# Altium schematic sheet uC_pwr.SchDoc
size A4
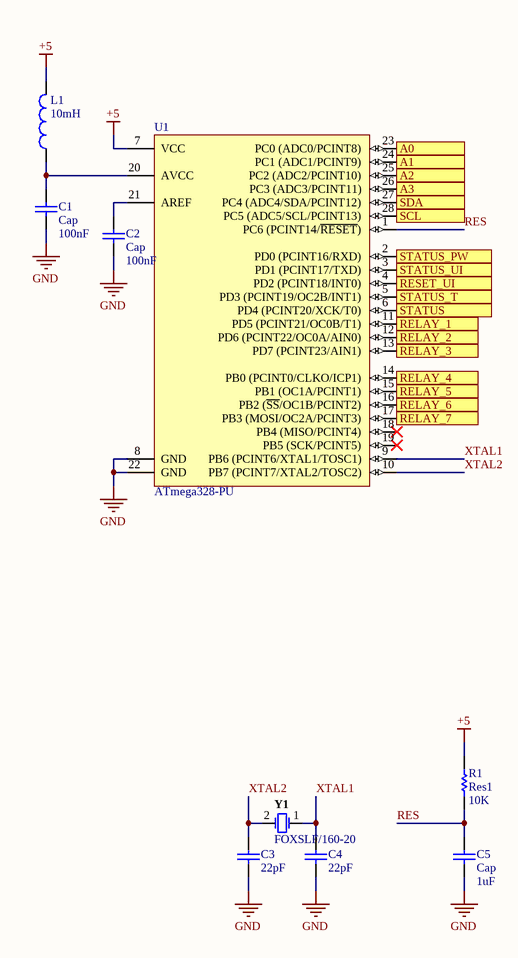
[diagram p0: uC_pwr.SchDoc]

## Parts
C1  Cap  value 100nF  [RAD-0.3]
C2  Cap  value 100nF  [RAD-0.3]
C3  value 22pF  [RAD-0.3]  (hidden comment: Cap)
C4  value 22pF  [RAD-0.3]  (hidden comment: Cap)
C5  Cap  value 1uF  [RAD-0.3]
L1  10mH  [INDR62-500-1100X850X1100]
R1  Res1  value 10K  [AXIAL-0.3]
U1  ATmega328-PU  [28P3]
Y1  FOXSLF/160-20  [FOX-FOXSLF160-20]

## Ports
A0 (in), A1 (in), A2 (in), A3 (in), RELAY_1 (out), RELAY_2 (out), RELAY_3 (out), RELAY_4 (out), RELAY_5 (out), RELAY_6 (out), RELAY_7 (out), RESET_UI (out), SCL (out), SDA (out), STATUS (in), STATUS_PW (out), STATUS_T (out), STATUS_UI (in)

## Nets
+5: L1.2 R1.2 U1.7(VCC)
GND: C1.1 C2.1 C3.1 C4.1 C5.1 U1.8(GND) U1.22(GND)
A0: U1.23(PC0_(ADC0/PCINT8)) ; port A0
A1: U1.24(PC1_(ADC1/PCINT9)) ; port A1
A2: U1.25(PC2_(ADC2/PCINT10)) ; port A2
A3: U1.26(PC3_(ADC3/PCINT11)) ; port A3
RELAY_1: U1.11(PD5_(PCINT21/OC0B/T1)) ; port RELAY_1
RELAY_2: U1.12(PD6_(PCINT22/OC0A/AIN0)) ; port RELAY_2
RELAY_3: U1.13(PD7_(PCINT23/AIN1)) ; port RELAY_3
RELAY_4: U1.14(PB0_(PCINT0/CLKO/ICP1)) ; port RELAY_4
RELAY_5: U1.15(PB1_(OC1A/PCINT1)) ; port RELAY_5
RELAY_6: U1.16(PB2_(~{SS}/OC1B/PCINT2)) ; port RELAY_6
RELAY_7: U1.17(PB3_(MOSI/OC2A/PCINT3)) ; port RELAY_7
RES: C5.2 R1.1 U1.1(PC6_(PCINT14/~{RESET}))
RESET_UI: U1.4(PD2_(PCINT18/INT0)) ; port RESET_UI
SCL: U1.28(PC5_(ADC5/SCL/PCINT13)) ; port SCL
SDA: U1.27(PC4_(ADC4/SDA/PCINT12)) ; port SDA
STATUS: U1.6(PD4_(PCINT20/XCK/T0)) ; port STATUS
STATUS_PW: U1.2(PD0_(PCINT16/RXD)) ; port STATUS_PW
STATUS_T: U1.5(PD3_(PCINT19/OC2B/INT1)) ; port STATUS_T
STATUS_UI: U1.3(PD1_(PCINT17/TXD)) ; port STATUS_UI
XTAL1: C4.2 U1.9(PB6_(PCINT6/XTAL1/TOSC1)) Y1.1
XTAL2: C3.2 U1.10(PB7_(PCINT7/XTAL2/TOSC2)) Y1.2
NetC1_2: C1.2 L1.1 U1.20(AVCC)
NetC2_2: C2.2 U1.21(AREF)

Not connected (* = marked no-connect by the designer): U1 18(PB4_(MISO/PCINT4))* 19(PB5_(SCK/PCINT5))*

## Library data of the parts
C1-C5 = Cap: Capacitor; Published: 8-Jun-2000; LatestRevisionDate: 17-Jul-2002; LatestRevisionNote: Re-released for DXP Platform.; PackageReference: RAD-0.3; Publisher: Altium Limited; PackageDescription: Radial Cap, Thru-Hole; 2 Leads; 0.3 in Pin Spacing
L1 = CMP-1747-00016-1: Radial Inductor, 10 uH, +/- 10%, 3 A, -55 to 105 degC, 2-Pin THD, RoHS, Bulk; Outputs: 4; Case\Package: DIP; Output Voltage: 36 V; Interface: Parallel; Min Supply Voltage: 4.5 V; Output Current: 600 mA; Max Operating Temperature: 70 degC; PackageDescription: 2-Pin Radial Lead, Dia 8.5 mm, Pitch 5 mm; Min Operating Temperature: 0 degC; ComponentLink2Description: Datasheet; Mount: Through Hole; PackageReference: INDR62-500-1100X850X1100; REACH SVHC: No SVHC; Width: 0.25 inch; Package Quantity: 25; ComponentLink1Description: Manufacturer URL; Height: 0.25 inch; DatasheetVersion: Aug-10; Packaging: Rail/Tube; Length: 0.75 inch; Max Supply Voltage: 36 V; RoHSCompliant: true; ComponentLink1URL: http://www.bourns.com/; Radiation Hardening: No; Weight: 0.03357 oz; Pins: 16; ComponentLink2URL: http://www.bourns.com/docs/Product-Datasheets/rl622_series.pdf
R1 = Res1: Resistor; Published: 8-Jun-2000; LatestRevisionDate: 17-Jul-2002; LatestRevisionNote: Re-released for DXP Platform.; PackageReference: AXIAL-0.3; Publisher: Altium Limited; PackageDescription: Axial Device, Thru-Hole; 2 Leads; 0.3 in Pin Spacing
U1 = CMP-0095-00015-2: 8-bit AVR Microcontroller, 32KB Flash, 1KB EEPROM, 2KB SRAM, 28-pin PDIP, Industrial Grade (-40°C to 85°C); ComponentLink3Description: ATmega48A/48PA/88A/88PA/168A/168PA/328/328P Summary; RevisionNote: DatasheetVersion updated. URLs added.; DatasheetVersion: revD, May-2011; ComponentLink1URL: http://www.atmel.com/; PackageVersion: revB, Sep-2001; PackageDescription: 28-lead (0.300"/7.62mm Wide) Plastic Dual Inline Package (PDIP); PackageReference: 28P3; ComponentLink1Description: Manufacturer URL; ComponentLink2Description: ATmega48A/48PA/88A/88PA/168A/168PA/328/328P Datasheet; ComponentLink3URL: http://www.atmel.com/dyn/resources/prod_documents/8271S.pdf; ComponentLink2URL: http://www.atmel.com/dyn/resources/prod_documents/8271.pdf
Y1 = CMP-1749-00003-1: Resistance Weld Thru-Hole Crystal, 16 MHz, -20 to 70 degC, 2-Pin THD, RoHS, Bulk; Voltage Rating: 250 V; Tolerance: 1%; Resistance: 221 kohm; Case\Package: Axial; Power Rating: 250 mW; RoHSCompliant: true; Package Quantity: 200; Packaging: Bulk; Min Operating Temperature: -55 degC; DatasheetVersion: Mar-15; ComponentLink1URL: http://www.foxonline.com/; Max Operating Temperature: 155 degC; PackageReference: FOXSLF160-20; Mount: Through Hole; PackageDescription: 2-Pin Through Hole Device, Body 11.35 x 4.65 mm; ComponentLink1Description: Manufacturer URL; ComponentLink2URL: http://www.foxonline.com/pdfs/hc49slf.pdf; ComponentLink2Description: Datasheet; Length: 0.248 inch